# Altium schematic sheet connectors.SchDoc
size A; SheetNumber: 10; SheetTotal: 10
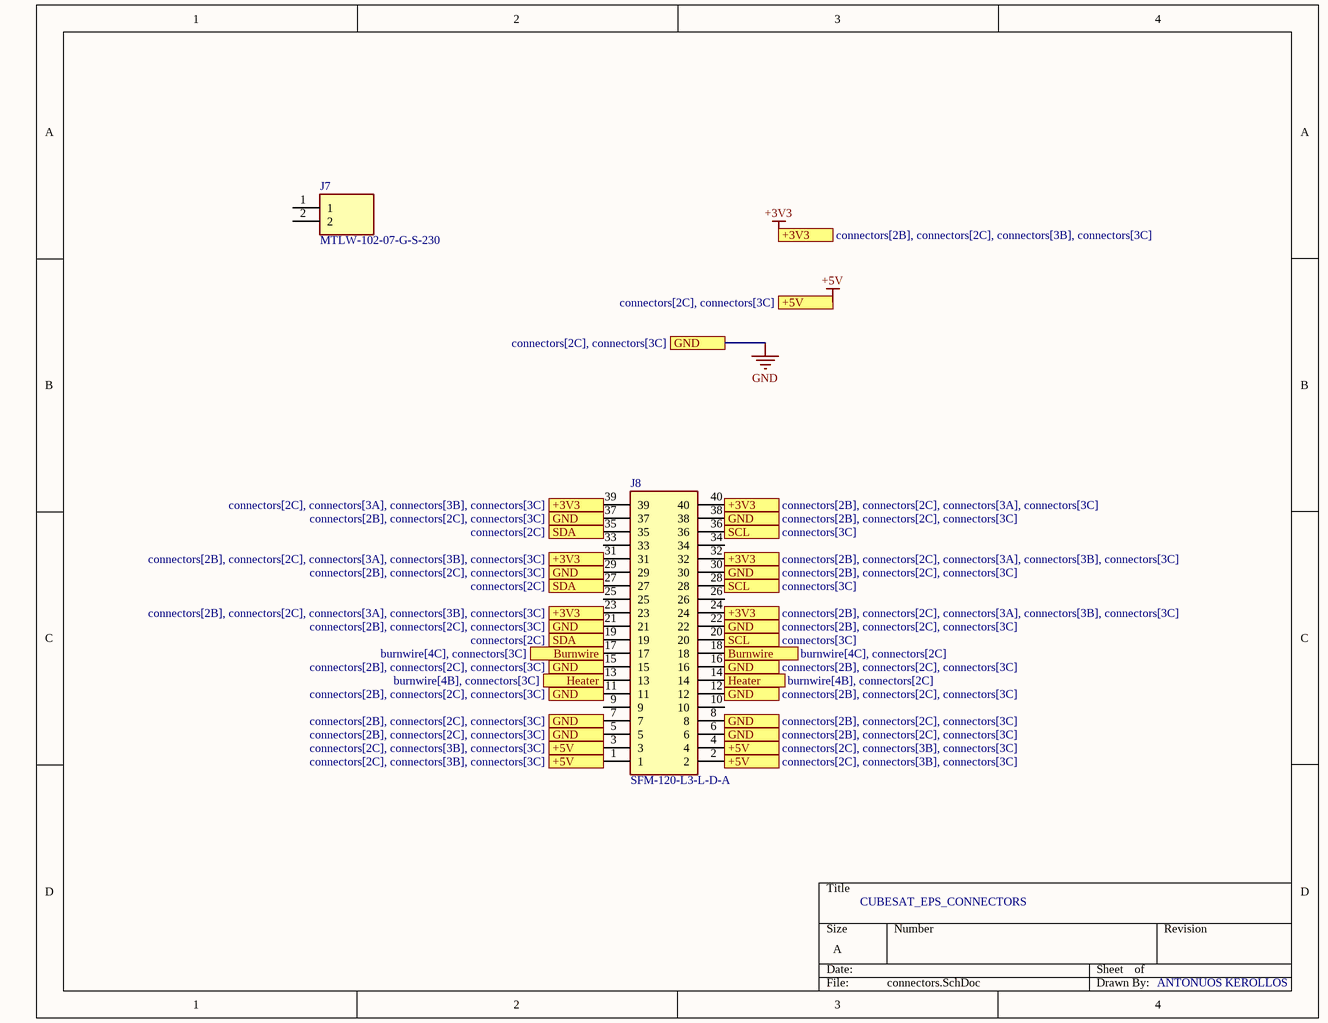
[diagram p0: connectors.SchDoc]

## Parts
J7  MTLW-102-07-G-S-230  [HDRV2W82P0X254_1X2_508X249X876P]
J8  SFM-120-L3-L-D-A  [SFM-120-YY-XX-D-A]

## Ports
+3V3 (see connectors[2B], connectors[2C], connectors[3A], connectors[3B], connectors[3C]), +3V3 (see connectors[2B], connectors[2C], connectors[3A], connectors[3C]), +3V3 (see connectors[2B], connectors[2C], connectors[3B], connectors[3C]), +3V3 (see connectors[2C], connectors[3A], connectors[3B], connectors[3C]), +5V (see connectors[2C], connectors[3B], connectors[3C]), +5V (see connectors[2C], connectors[3C]), Burnwire (see burnwire[4C], connectors[2C]), Burnwire (see burnwire[4C], connectors[3C]), GND (see connectors[2B], connectors[2C], connectors[3C]), GND (see connectors[2C], connectors[3C]), Heater (see burnwire[4B], connectors[2C]), Heater (see burnwire[4B], connectors[3C]), SCL (see connectors[3C]), SDA (see connectors[2C])

## Nets
+3V3: J8.23 J8.24 J8.31 J8.32 J8.39 J8.40 ; port +3V3
+5V: J8.1 J8.2 J8.3 J8.4 ; port +5V
GND: J8.5 J8.6 J8.7 J8.8 J8.11 J8.12 J8.15 J8.16 J8.21 J8.22 J8.29 J8.30 J8.37 J8.38 ; port GND
Burnwire: J8.17 J8.18 ; port Burnwire
Heater: J8.13 J8.14 ; port Heater
SCL: J8.20 J8.28 J8.36 ; port SCL
SDA: J8.19 J8.27 J8.35 ; port SDA

Not connected (* = marked no-connect by the designer): J7 1 2; J8 9 10 25 26 33 34

## Notes on the sheet
- CUBESAT_EPS_CONNECTORS
- ANTONUOS KEROLLOS

## Library data of the parts
J7 = MTLW-102-07-G-S-230: Connector; Manufacturer_Name: SAMTEC; Datasheet Link: https://componentsearchengine.com/Datasheets/1/MTLW-102-07-G-S-230.pdf; Height: 8.76mm; Manufacturer_Part_Number: MTLW-102-07-G-S-230; Mouser Part Number: 200-MTLW10207GS230; Mouser Price/Stock: https://www.mouser.com/Search/Refine.aspx?Keyword=200-MTLW10207GS230; Arrow Part Number: MTLW-102-07-G-S-230; Arrow Price/Stock: https://www.arrow.com/en/products/mtlw-102-07-g-s-230/samtec
J8 = SFM-120-L3-L-D-A: Connector; Manufacturer_Name: SAMTEC; Datasheet Link: http://suddendocs.samtec.com/prints/sfm-1xx-xx-xxx-d-xxx-mkt.pdf; Manufacturer_Part_Number: SFM-120-L3-L-D-A